# Altium schematic sheet noeud3.SchDoc
size A4
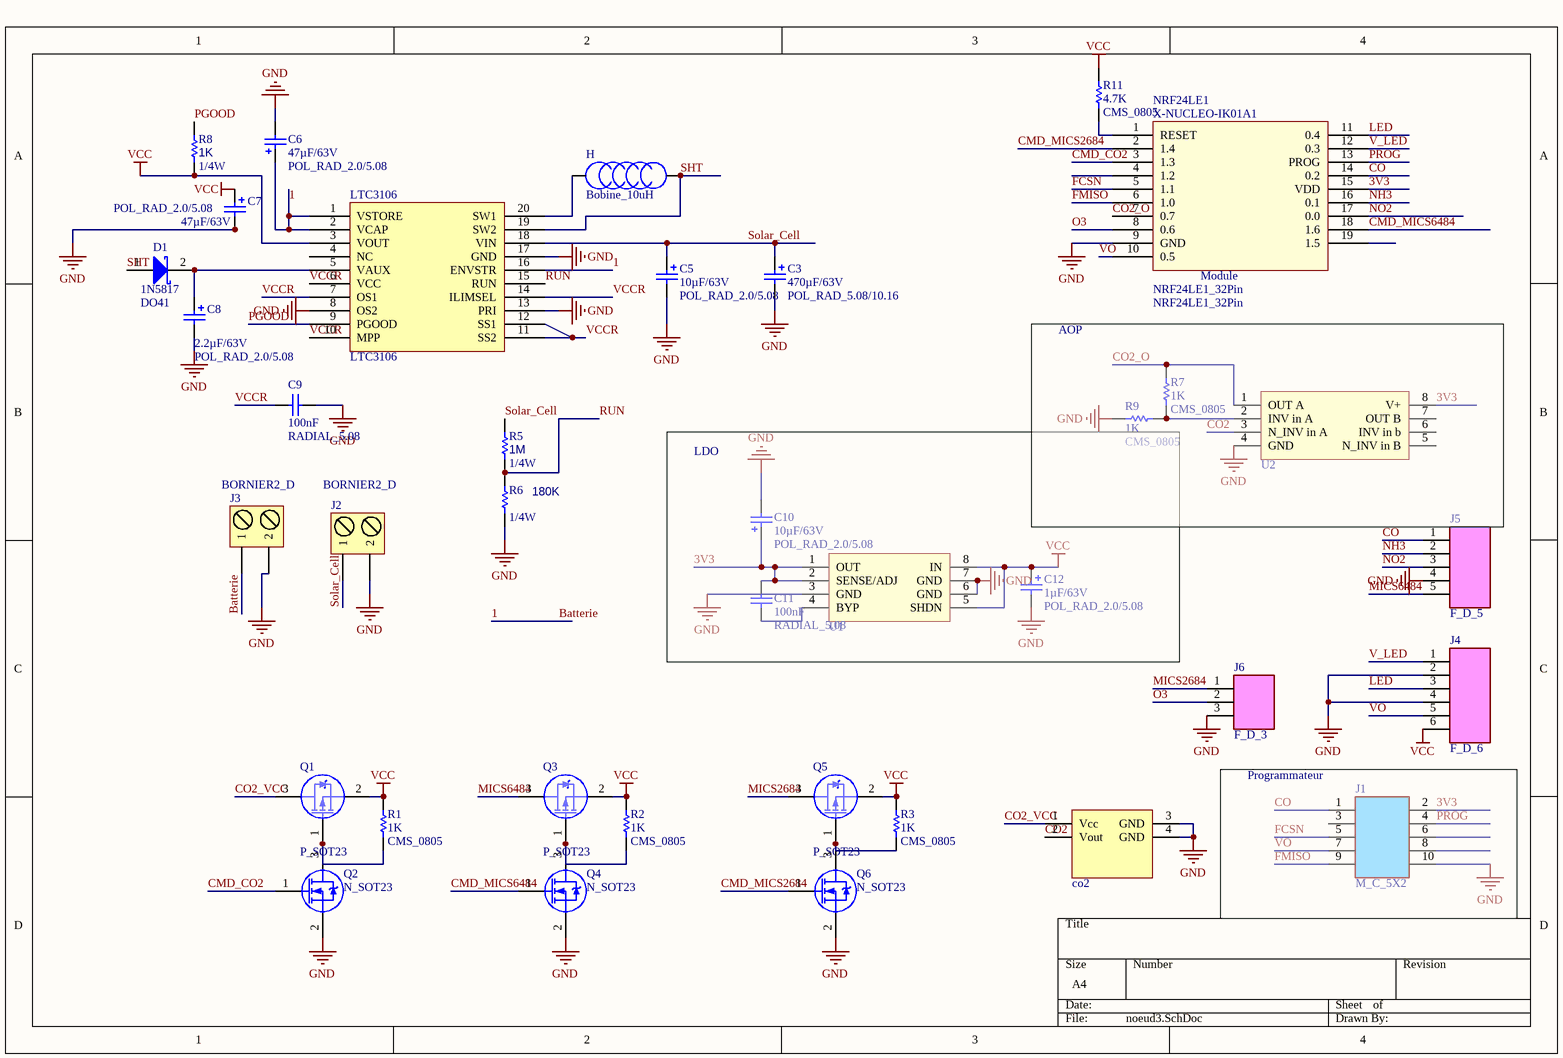
[diagram p0: noeud3.SchDoc]

## Parts
C3  value 470µF/63V  Type: POL_RAD_5.08/10.16  [CONDENSATEUR_POLARISE_ELECTROLYTIQUE_RADIAL_5.08/10.16]  (hidden comment: CONDENSATEUR_POL_ELECTROLY_RAD_5.08/10.16)
C5  value 10µF/63V  Type: POL_RAD_2.0/5.08  [CONDENSATEUR_POLARISE_ELECTROLYTIQUE_RADIAL_2.0/5.08]  (hidden comment: CONDENSATEUR_POL_ELECTROLY_RAD_2.0/5.08)
C6  value 47µF/63V  Type: POL_RAD_2.0/5.08  [CONDENSATEUR_POLARISE_ELECTROLYTIQUE_RADIAL_2.0/5.08]  (hidden comment: CONDENSATEUR_POL_ELECTROLY_RAD_2.0/5.08)
C7  value 47µF/63V  Type: POL_RAD_2.0/5.08  [CONDENSATEUR_POLARISE_ELECTROLYTIQUE_RADIAL_2.0/5.08]  (hidden comment: CONDENSATEUR_POL_ELECTROLY_RAD_2.0/5.08)
C8  value 2.2µF/63V  Type: POL_RAD_2.0/5.08  [CONDENSATEUR_POLARISE_ELECTROLYTIQUE_RADIAL_2.0/5.08]  (hidden comment: CONDENSATEUR_POL_ELECTROLY_RAD_2.0/5.08)
C9  value 100nF  Type: RADIAL_5.08  [CONDENSATEUR_CERAMIQUE_RADIAL_5.08]  (hidden comment: CONDENSATEUR_CER_RAD_5.08)
C10  value 10µF/63V  Type: POL_RAD_2.0/5.08  [CONDENSATEUR_POLARISE_ELECTROLYTIQUE_RADIAL_2.0/5.08]  (hidden comment: CONDENSATEUR_POL_ELECTROLY_RAD_2.0/5.08)
C11  value 100nF  Type: RADIAL_5.08  [CONDENSATEUR_CERAMIQUE_RADIAL_5.08]  (hidden comment: CONDENSATEUR_CER_RAD_5.08)
C12  value 1µF/63V  Type: POL_RAD_2.0/5.08  [CONDENSATEUR_POLARISE_ELECTROLYTIQUE_RADIAL_2.0/5.08]  (hidden comment: CONDENSATEUR_POL_ELECTROLY_RAD_2.0/5.08)
co2  -6pins  [PCBComponent_1]  (value not drawn)
D1  Type: 1N5817  Package: DO41  [DIODE_DO41]  (hidden comment: DIODE_SCHOTTKY_DO41 : 1N5817)
H  Type: Bobine_10uH  [SELF]  (hidden comment: Bobine_22nH)
J1  Type: M_C_5X2  [BARRETTE_5X2_M_C]  (hidden comment: BARRETTE_5 CONTACTS_2 RANGEES_MALE_COUDEE)
J2  Type: BORNIER2_D  [BORNIER2_A_VIS]  (hidden comment: BORNIER2 DROIT A VIS)
J3  Type: BORNIER2_D  [BORNIER2_A_VIS]  (hidden comment: BORNIER2 DROIT A VIS)
J4  Type: F_D_6  [BARRETTE_6_F_D]  (hidden comment: BARRETTE_6 CONTACTS_1 RANGEE_FEMELLE_DROITE)
J5  Type: F_D_5  [BARRETTE_5_F_D]  (hidden comment: BARRETTE_5 CONTACTS_1 RANGEE_FEMELLE_DROITE)
J6  Type: F_D_3  [BARRETTE_3_F_D]  (hidden comment: BARRETTE 3 CONTACTS 1 RANGEE FEMELLE DROITE)
LTC3106  LTC3106_Regulateur  [ltc3106]  (value not drawn)
NRF24LE1  NRF24LE1_32Pin  [NRF24LE1 SMD]
Q1  Package: P_SOT23  [TRANSISTOR_MOSFET-P_SOT23_GSD]  (hidden comment: TRANSISTOR_MOSFET-P_SOT23_GSD)
Q2  Package: N_SOT23  [TRANSISTOR_MOSFET-N_SOT23_GSD]  (hidden comment: TRANSISTOR_MOSFET-N_SOT23_GSD)
Q3  Package: P_SOT23  [TRANSISTOR_MOSFET-P_SOT23_GSD]  (hidden comment: TRANSISTOR_MOSFET-P_SOT23_GSD)
Q4  Package: N_SOT23  [TRANSISTOR_MOSFET-N_SOT23_GSD]  (hidden comment: TRANSISTOR_MOSFET-N_SOT23_GSD)
Q5  Package: P_SOT23  [TRANSISTOR_MOSFET-P_SOT23_GSD]  (hidden comment: TRANSISTOR_MOSFET-P_SOT23_GSD)
Q6  Package: N_SOT23  [TRANSISTOR_MOSFET-N_SOT23_GSD]  (hidden comment: TRANSISTOR_MOSFET-N_SOT23_GSD)
R1  value 1K  Type: CMS_0805  [RESISTANCE_CMS_0805]  (hidden comment: RESISTANCE_CMS_0805)
R2  value 1K  Type: CMS_0805  [RESISTANCE_CMS_0805]  (hidden comment: RESISTANCE_CMS_0805)
R3  value 1K  Type: CMS_0805  [RESISTANCE_CMS_0805]  (hidden comment: RESISTANCE_CMS_0805)
R5  value 1M  Type: 1/4W  [RESISTANCE_1/4W]  (hidden comment: RESISTANCE_AXIALE_1/4W)
R6  value 180K  Type: 1/4W  [RESISTANCE_1/4W]  (hidden comment: RESISTANCE_AXIALE_1/4W)
R7  value 1K  Type: CMS_0805  [RESISTANCE_CMS_0805]  (hidden comment: RESISTANCE_CMS_0805)
R8  value 1K  Type: 1/4W  [RESISTANCE_1/4W]  (hidden comment: RESISTANCE_AXIALE_1/4W)
R9  value 1K  Type: CMS_0805  [RESISTANCE_CMS_0805]  (hidden comment: RESISTANCE_CMS_0805)
R11  value 4.7K  Type: CMS_0805  [RESISTANCE_CMS_0805]  (hidden comment: RESISTANCE_CMS_0805)
U1  LT1763_S8  [LT1763-8N]  (value not drawn)
U2  LM158_SOIC8  [LT1763-8N]  (value not drawn)

## Blocks framed on the sheet
AOP: R7 R9 U2
LDO: C10-C12 U1
Programmateur: J1

## Nets
GND: C3.2 C5.2 C6.2 C7.2 C8.2 C9.2 C10.2 C12.2 co2.3(GND) co2.4(GND) J1.10 J2.2 J3.2 J4.2 J4.4 J5.4 J6.3 LTC3106.8(OS2) LTC3106.13(PRI) LTC3106.17(GND) NRF24LE1.9(GND) Q2.2(S) Q4.2(S) Q6.2(S) R6.1 R9.2 U1.3(GND) U1.6(GND) U1.7(GND) U2.4(GND)
VCC: C7.1 C12.1 J4.6 LTC3106.3(VOUT) Q1.2(S) Q3.2(S) Q5.2(S) R1.1 R2.1 R3.1 R8.1 R11.2 U1.5(SHDN) U1.8(IN)
1: C6.1 J3.1 LTC3106.1(VSTORE) LTC3106.2(VCAP) LTC3106.16(ENVSTR)  [also labelled Batterie]
3V3: C10.1 C11.2 J1.2 NRF24LE1.15(VDD) U1.1(OUT) U1.2(SENSE/ADJ) U2.8(V+)
CMD_CO2: NRF24LE1.3(1.3) Q2.1(G)
CMD_MICS2684: NRF24LE1.2(1.4) Q6.1(G)
CMD_MICS6484: NRF24LE1.18(1.6) Q4.1(G)
CO: J1.1 J5.1 NRF24LE1.14(0.2)
CO2: co2.2(Vout) U2.3(N_INV_in_A)
CO2_O: NRF24LE1.7(0.7) R7.2 U2.1(OUT_A)
CO2_VCC: co2.1(Vcc) Q1.3(D)
FCSN: J1.5 NRF24LE1.5(1.1)
FMISO: J1.9 NRF24LE1.6(1.0)
LED: J4.3 NRF24LE1.11(0.4)
MICS2684: J6.1 Q5.3(D)
MICS6484: J5.5 Q3.3(D)
NH3: J5.2 NRF24LE1.16(0.1)
NO2: J5.3 NRF24LE1.17(0.0)
O3: J6.2 NRF24LE1.8(0.6)
PGOOD: LTC3106.9(PGOOD) R8.2
PROG: J1.4 NRF24LE1.13(PROG)
RUN: LTC3106.15(RUN) R5.1 R6.2
SHT: D1.1 H.2 LTC3106.19(SW2)
Solar_Cell: C3.1 C5.1 J2.1 LTC3106.18(VIN) R5.2
V_LED: J4.1 NRF24LE1.12(0.3)
VCCR: C9.1 LTC3106.6(VCC) LTC3106.7(OS1) LTC3106.10(MPP) LTC3106.11(SS2) LTC3106.12(SS1) LTC3106.14(ILIMSEL)
VO: J1.7 J4.5 NRF24LE1.10(0.5)
NetC8_1: C8.1 D1.2 LTC3106.5(VAUX)
NetC11_1: C11.1 U1.4(BYP)
NetH_1: H.1 LTC3106.20(SW1)
NetNRF24LE1_1: NRF24LE1.1(RESET) R11.1
NetQ1_1: Q1.1(G) Q2.3(D) R1.2
NetQ3_1: Q3.1(G) Q4.3(D) R2.2
NetQ5_1: Q5.1(G) Q6.3(D) R3.2
NetR7_1: R7.1 R9.1 U2.2(INV_in_A)

Not connected (* = marked no-connect by the designer): J1 3 6 8; LTC3106 4(NC); NRF24LE1 4(1.2) 19(1.5); U2 5(N_INV_in_B) 6(INV_in_b) 7(OUT_B)

## Notes on the sheet
- (in symbol NRF24LE1_32Pin) X-NUCLEO-IK01A1; Module

## Library data of the parts
C3 = CONDENSATEUR_POL_ELECTROLY_RAD_5.08/10.16: CONDENSATEUR POLARISE ELECTROLYTIQUE RADIAL 5.08/10.16
C5-C8 C10 C12 = CONDENSATEUR_POL_ELECTROLY_RAD_2.0/5.08: CONDENSATEUR POLARISE ELECTROLYTIQUE RADIAL 2.0/5.08
C9 C11 = CONDENSATEUR_CER_RAD_5.08: CONDENSATEUR TRAVERSANT CERAMIQUE RADIAL 5.08mm
co2 = capteur_co2
D1 = DIODE_SCHOTTKY_DO41 : 1N5817: DIODE SCHOTTKY DO41 : 1N5817
J1 = BARRETTE_5 CONTACTS_2 RANGEES_MALE_COUDEE: BARRETTE 5 CONTACTS 2 RANGEES MALE COUDEE
J2 J3 = BORNIER2_DROIT_A VIS: BORNIER 2 PLOTS DROIT A VIS 5.08mm
J4 = BARRETTE_6 CONTACTS_1 RANGEE_FEMELLE_DROITE: BARRETTE 6 CONTACTS 1 RANGEE FEMELLE DROITE
J5 = BARRETTE_5 CONTACTS_1 RANGEE_FEMELLE_DROITE: BARRETTE 5 CONTACTS 1 RANGEE FEMELLE DROITE
J6 = BARRETTE_3 CONTACTS_1 RANGEE_FEMELLE_DROITE
LTC3106 = LTC31068FE PACKAGE: LTC3106_Regulateur_MPC; Type: LTC3106
Q1 Q3 Q5 = TRANSISTOR_MOSFET-P_SOT23_GSD: TRANSISTOR MOSFET CANAL P BOITIER SOT23_GSD
Q2 Q4 Q6 = TRANSISTOR_MOSFET-N_SOT23_GSD: TRANSISTOR MOSFET CANAL N BOITIER SOT23_GSD
R1-R3 R7 R9 R11 = RESISTANCE_CMS_0805: RESISTANCE CMS 0805
R5 R6 R8 = RESISTANCE_AXIALE_1/4W: RESISTANCE TRAVERSANTE AXIALE 1/4W
U1 = LT1763_S8_LDO_3V3_S8: LDO 3V3 S8; Type: LT1763_S8
U2 = LM_AOP_SOIC: AOP_LM158 - SOIC8